# Altium schematic sheet Smart_Clock_ver2esp32.SchDoc
size A2
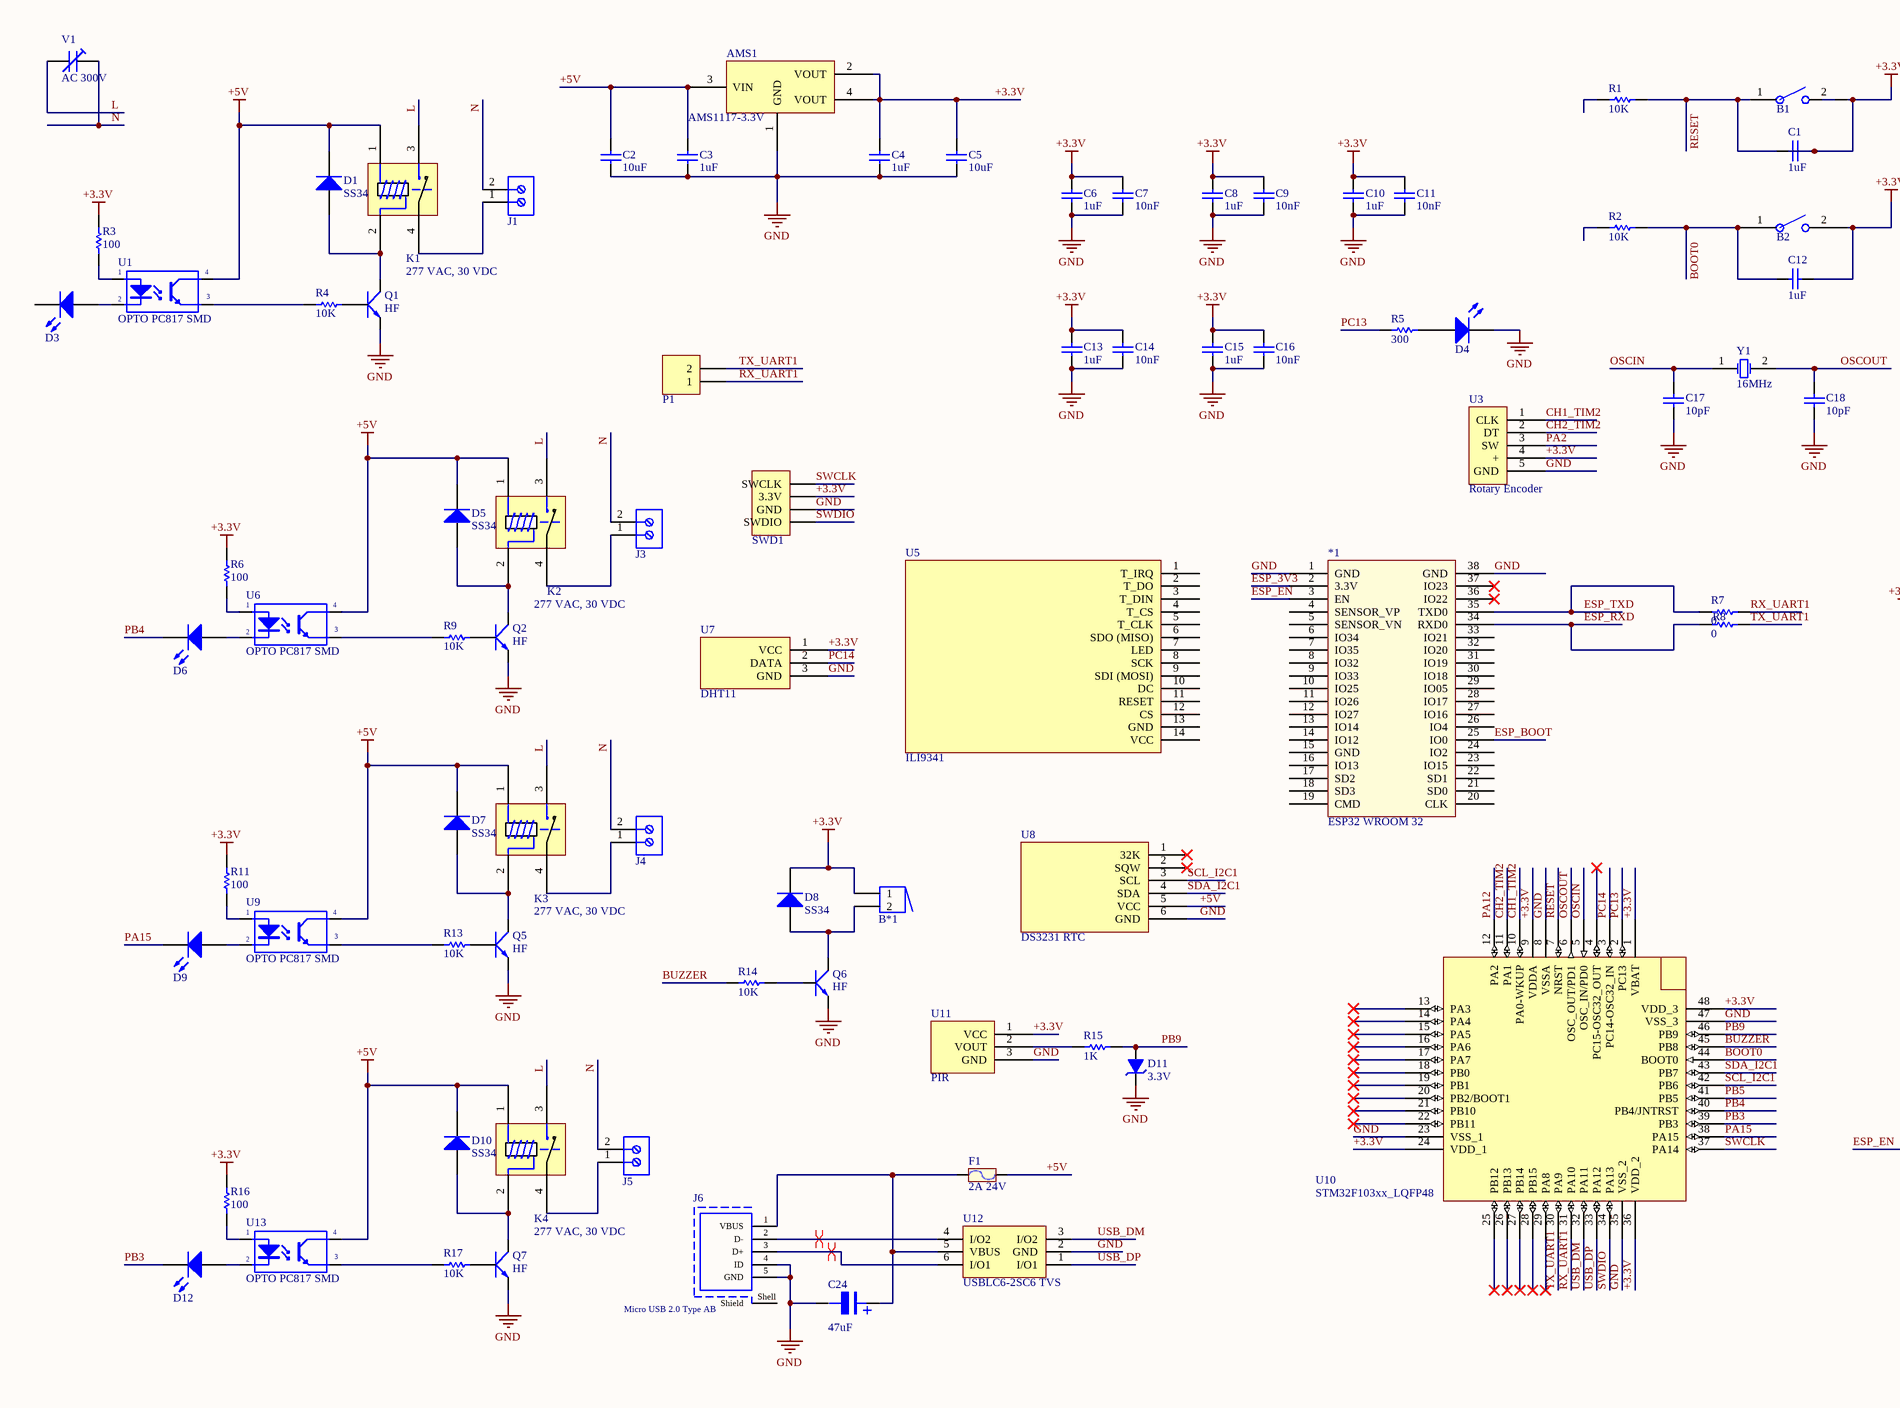
[diagram p0: Smart_Clock_ver2esp32.SchDoc, left]
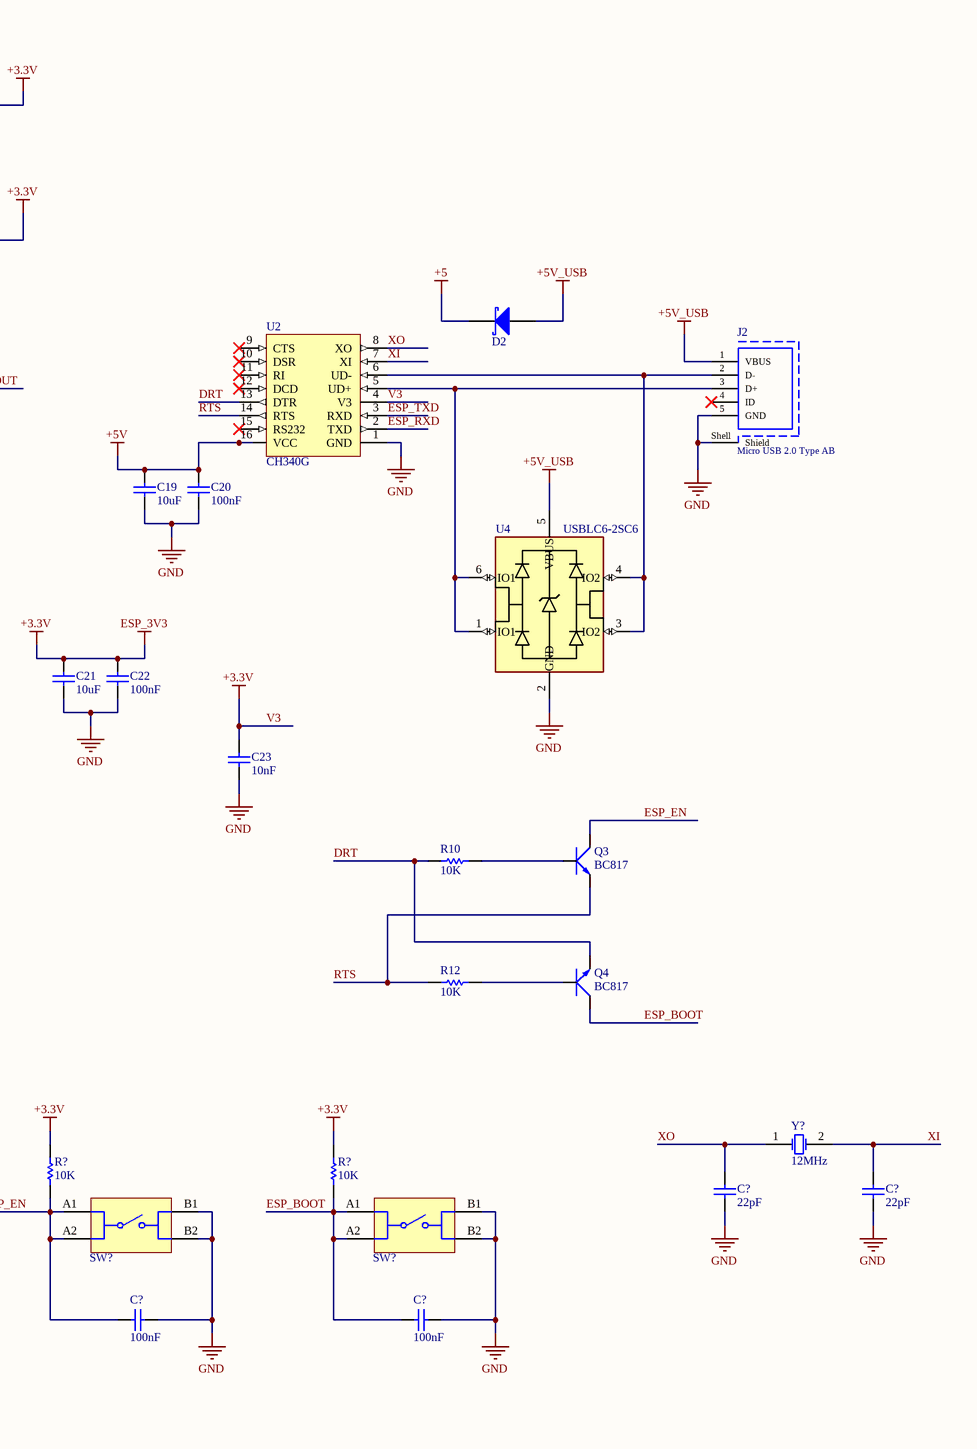
[diagram p1: Smart_Clock_ver2esp32.SchDoc, right]

## Parts
(Parts that share a designator on the sheet are numbered #1, #2 ... from top to bottom, then left to right.)
*1  ESP32 WROOM 32  [ESP32-WROOM-32D]
AMS1  AMS1117-3.3V  [SOT223]
B1  Button SMD 2 Pin 3x4mm  [BUTTON SMD 2 PIN]  (value not drawn)
B2  Button SMD 2 Pin 3x4mm  [BUTTON SMD 2 PIN]  (value not drawn)
B*1  Buzzer  [BUZZER]  (value not drawn)
C1  value 1uF  [CAP-SM-0805]  (hidden comment: Cap Non-Pol SMD)
C2  value 10uF  [CAP-SM-0805]  (hidden comment: Cap Non-Pol SMD)
C3  value 1uF  [CAP-SM-0805]  (hidden comment: Cap Non-Pol SMD)
C4  value 1uF  [CAP-SM-0805]  (hidden comment: Cap Non-Pol SMD)
C5  value 10uF  [CAP-SM-0805]  (hidden comment: Cap Non-Pol SMD)
C6  value 1uF  [CAP-SM-0805]  (hidden comment: Cap Non-Pol SMD)
C7  value 10nF  [CAP-SM-0805]  (hidden comment: Cap Non-Pol SMD)
C8  value 1uF  [CAP-SM-0805]  (hidden comment: Cap Non-Pol SMD)
C9  value 10nF  [CAP-SM-0805]  (hidden comment: Cap Non-Pol SMD)
C10  value 1uF  [CAP-SM-0805]  (hidden comment: Cap Non-Pol SMD)
C11  value 10nF  [CAP-SM-0805]  (hidden comment: Cap Non-Pol SMD)
C12  value 1uF  [CAP-SM-0805]  (hidden comment: Cap Non-Pol SMD)
C13  value 1uF  [CAP-SM-0805]  (hidden comment: Cap Non-Pol SMD)
C14  value 10nF  [CAP-SM-0805]  (hidden comment: Cap Non-Pol SMD)
C15  value 1uF  [CAP-SM-0805]  (hidden comment: Cap Non-Pol SMD)
C16  value 10nF  [CAP-SM-0805]  (hidden comment: Cap Non-Pol SMD)
C17  value 10pF  [CAP-SM-0805]  (hidden comment: Cap Non-Pol SMD)
C18  value 10pF  [CAP-SM-0805]  (hidden comment: Cap Non-Pol SMD)
C19  value 10uF  [CAP-SM-0805]  (hidden comment: Cap Non-Pol SMD)
C20  value 100nF  [CAP-SM-0805]  (hidden comment: Cap Non-Pol SMD)
C21  value 10uF  [CAP-SM-0805]  (hidden comment: Cap Non-Pol SMD)
C22  value 100nF  [CAP-SM-0805]  (hidden comment: Cap Non-Pol SMD)
C23  value 10nF  [CAP-SM-0805]  (hidden comment: Cap Non-Pol SMD)
C24  47uF  [tu nhom 6.3 (d)]
C?#1  value 22pF  [CAP-SM-0805]  (hidden comment: Cap Non-Pol SMD)
C?#2  value 22pF  [CAP-SM-0805]  (hidden comment: Cap Non-Pol SMD)
C?#3  value 100nF  [CAP-SM-0805]  (hidden comment: Cap Non-Pol SMD)
C?#4  value 100nF  [CAP-SM-0805]  (hidden comment: Cap Non-Pol SMD)
D1  SS34  [DIODE SMA]
D2  D Schottky  [SS34]  (value not drawn)
D3  LED SMD  [LED_0805_Blue]  (value not drawn)
D4  LED SMD  [LED_0603_Blue]  (value not drawn)
D5  SS34  [DIODE SMA]
D6  LED SMD  [LED_0805_Blue]  (value not drawn)
D7  SS34  [DIODE SMA]
D8  SS34  [DIODE SMA]
D9  LED SMD  [LED_0805_Blue]  (value not drawn)
D10  SS34  [DIODE SMA]
D11  3.3V  [DIODE ZENNER SMD SOD80]
D12  LED SMD  [LED_0805_Blue]  (value not drawn)
F1  2A 24V  [Cau chi tu phuc hoi 2A 24V SMD1812]
J1  10A, 300V  [691214110002]  (value not drawn)
J2  Micro USB 2.0 Type AB  [629105150921]
J3  10A, 300V  [691214110002]  (value not drawn)
J4  10A, 300V  [691214110002]  (value not drawn)
J5  10A, 300V  [691214110002]  (value not drawn)
J6  Micro USB 2.0 Type AB  [629105150921]
K1  277 VAC, 30 VDC  [HF46F]
K2  277 VAC, 30 VDC  [HF46F]
K3  277 VAC, 30 VDC  [HF46F]
K4  277 VAC, 30 VDC  [HF46F]
P1  Header 2  [JP2]  (value not drawn)
Q1  HF  [SOT-23]
Q2  HF  [SOT-23]
Q3  BC817  [SOT-23]
Q4  BC817  [SOT-23]
Q5  HF  [SOT-23]
Q6  HF  [SOT-23]
Q7  HF  [SOT-23]
R1  value 10K  [RES-SM-0805]  (hidden comment: RESISTOR SMD)
R2  value 10K  [RES-SM-0805]  (hidden comment: RESISTOR SMD)
R3  value 100  [RES-SM-0805]  (hidden comment: RESISTOR SMD)
R4  value 10K  [RES-SM-0805]  (hidden comment: RESISTOR SMD)
R5  value 300  [RES-SM-0805]  (hidden comment: RESISTOR SMD)
R6  value 100  [RES-SM-0805]  (hidden comment: RESISTOR SMD)
R7  value 0  [RES-SM-0805]  (hidden comment: RESISTOR SMD)
R8  value 0  [RES-SM-0805]  (hidden comment: RESISTOR SMD)
R9  value 10K  [RES-SM-0805]  (hidden comment: RESISTOR SMD)
R10  value 10K  [RES-SM-0805]  (hidden comment: RESISTOR SMD)
R11  value 100  [RES-SM-0805]  (hidden comment: RESISTOR SMD)
R12  value 10K  [RES-SM-0805]  (hidden comment: RESISTOR SMD)
R13  value 10K  [RES-SM-0805]  (hidden comment: RESISTOR SMD)
R14  value 10K  [RES-SM-0805]  (hidden comment: RESISTOR SMD)
R15  value 1K  [RES-SM-0805]  (hidden comment: RESISTOR SMD)
R16  value 100  [RES-SM-0805]  (hidden comment: RESISTOR SMD)
R17  value 10K  [RES-SM-0805]  (hidden comment: RESISTOR SMD)
R?#1  value 10K  [RES-SM-0805]  (hidden comment: RESISTOR SMD)
R?#2  value 10K  [RES-SM-0805]  (hidden comment: RESISTOR SMD)
SW?#1  430181038816  [WS-TASV_L4.5W4.5H3.8_430181038816]  (value not drawn)
SW?#2  430181038816  [WS-TASV_L4.5W4.5H3.8_430181038816]  (value not drawn)
SWD1  Header 4  [JP4]  (value not drawn)
U1  OPTO PC817 SMD  [SOP4]
U2  CH340G  [DSIP-16]
U3  Rotary Encoder  [Header 5 Pin]
U4  USBLC6-2SC6  [SOT95P280X145-6N]
U5  ILI9341  [ILI9341]
U6  OPTO PC817 SMD  [SOP4]
U7  DHT11  [DHT11]
U8  DS3231 RTC  [DS3231]
U9  OPTO PC817 SMD  [SOP4]
U10  STM32F103xx_LQFP48  [STM32_LQPF48]
U11  PIR  [PIR]
U12  USBLC6-2SC6 TVS  [SOT23-6]
U13  OPTO PC817 SMD  [SOP4]
V1  AC 300V  [Varistor]
Y1  16MHz  [WE-XTAL_HC49/4HSMX]
Y?  12MHz  [WE-XTAL_HC49/4HSMX]

## Nets
+3.3V: *1.2(3.3V) AMS1.2(VOUT) AMS1.4(VOUT) B1.2 B2.2 B*1.1 C1.2 C4.2 C5.2 C6.2 C7.2 C8.2 C9.2 C10.2 C11.2 C12.2 C13.2 C14.2 C15.2 C16.2 C21.2 C22.2 C23.2 D8.2(K) R3.2 R6.2 R11.2 R16.2 R?#1.2 R?#2.2 SWD1.3(3.3V) U2.4(V3) U3.4(+) U7.1(VCC) U10.1(VBAT) U10.9(VDDA) U10.24(VDD_1) U10.36(VDD_2) U10.48(VDD_3) U11.1(VCC)  [also labelled ESP_3V3, V3]
+5: D2.2(K)
+5V: AMS1.3(VIN) C2.2 C3.2 C19.2 C20.2 D1.2(K) D5.2(K) D7.2(K) D10.2(K) F1.2 K1.1(Coil) K2.1(Coil) K3.1(Coil) K4.1(Coil) U1.4(C) U2.16(VCC) U6.4(C) U8.5(VCC) U9.4(C) U13.4(C)
+5V_USB: D2.1(A) J2.1(VBUS) U4.5(VBUS)
GND: *1.1(GND) *1.38(GND) AMS1.1(GND) C2.1 C3.1 C4.1 C5.1 C6.1 C7.1 C8.1 C9.1 C10.1 C11.1 C13.1 C14.1 C15.1 C16.1 C17.2 C18.2 C19.1 C20.1 C21.1 C22.1 C23.1 C24.2 C?#1.2 C?#2.2 C?#3.2 C?#4.1 D4.2(K) D11.2(K) J2.5(GND) J2.Shell(Shield) J6.4(ID) J6.5(GND) Q1.2(E) Q2.2(E) Q5.2(E) Q6.2(E) Q7.2(E) SW?#1.B1 SW?#1.B2 SW?#2.B1 SW?#2.B2 SWD1.2(GND) U2.1(GND) U3.5(GND) U4.2(GND) U7.3(GND) U8.6(GND) U10.8(VSSA) U10.23(VSS_1) U10.35(VSS_2) U10.47(VSS_3) U11.3(GND) U12.2(GND)
BOOT0: B2.1 C12.1 R2.2 U10.44(BOOT0)
BUZZER: R14.1 U10.45(PB8)
CH1_TIM2: U3.1(CLK) U10.10(PA0-WKUP)
CH2_TIM2: U3.2(DT) U10.11(PA1)
DRT: Q4.2(E) R10.1 U2.13(DTR)
ESP_BOOT: *1.25(IO0) C?#4.2 Q4.3(C) R?#2.1 SW?#2.A1 SW?#2.A2
ESP_EN: *1.3(EN) C?#3.1 Q3.3(C) R?#1.1 SW?#1.A1 SW?#1.A2
ESP_RXD: *1.34(RXD0) R8.1 U2.2(TXD)
ESP_TXD: *1.35(TXD0) R7.1 U2.3(RXD)
L: K1.3(NO) K2.3(NO) K3.3(NO) K4.3(NO) V1.1
N: J1.2 J3.2 J4.2 J5.2 V1.2
OSCIN: C17.1 U10.5(OSC_IN/PD0) Y1.1(OSC1)
OSCOUT: C18.1 U10.6(OSC_OUT/PD1) Y1.2(OSC2)
PA2: U3.3(SW)
PA12: U10.12(PA2)
PA15: D9.2(K) U10.38(PA15)
PB3: D12.2(K) U10.39(PB3)
PB4: D6.2(K) U10.40(PB4/JNTRST)
PB5: U10.41(PB5)
PB9: D11.1(A) R15.2 U10.46(PB9)
PC13: R5.1 U10.2(PC13)
PC14: U7.2(DATA) U10.3(PC14-OSC32_IN)
RESET: B1.1 C1.1 R1.2 U10.7(NRST)
RTS: Q3.2(E) R12.1 U2.14(RTS)
RX_UART1: P1.1 R7.2 U10.31(PA10)
SCL_I2C1: U8.3(SCL) U10.42(PB6)
SDA_I2C1: U8.4(SDA) U10.43(PB7)
SWCLK: SWD1.4(SWCLK) U10.37(PA14)
SWDIO: SWD1.1(SWDIO) U10.34(PA13)
TX_UART1: P1.2 R8.2 U10.30(PA9)
USB_DM: U10.32(PA11) U12.3(I/O2)
USB_DP: U10.33(PA12) U12.1(I/O1)
XI: C?#2.1 U2.7(XI) Y?.2(OSC2)
XO: C?#1.1 U2.8(XO) Y?.1(OSC1)
NetB*1_2: B*1.2 D8.1(A) Q6.3(C)
NetC24_1: C24.1 F1.1 J6.1(VBUS) U12.5(VBUS)
NetD1_1: D1.1(A) K1.2(Coil) Q1.3(C)
NetD3_1: D3.1(A) U1.2(K)
NetD4_1: D4.1(A) R5.2
NetD5_1: D5.1(A) K2.2(Coil) Q2.3(C)
NetD6_1: D6.1(A) U6.2(K)
NetD7_1: D7.1(A) K3.2(Coil) Q5.3(C)
NetD9_1: D9.1(A) U9.2(K)
NetD10_1: D10.1(A) K4.2(Coil) Q7.3(C)
NetD12_1: D12.1(A) U13.2(K)
NetJ1_1: J1.1 K1.4
NetJ2_2: J2.2(D-) U2.6(UD-) U4.3(IO2) U4.4(IO2)
NetJ2_3: J2.3(D+) U2.5(UD+) U4.1(IO1) U4.6(IO1)
NetJ3_1: J3.1 K2.4
NetJ4_1: J4.1 K3.4
NetJ5_1: J5.1 K4.4
NetJ6_2: J6.2(D-) U12.4(I/O2)
NetJ6_3: J6.3(D+) U12.6(I/O1)
NetQ1_1: Q1.1(B) R4.1
NetQ2_1: Q2.1(B) R9.1
NetQ3_1: Q3.1(B) R10.2
NetQ4_1: Q4.1(B) R12.2
NetQ5_1: Q5.1(B) R13.1
NetQ6_1: Q6.1(B) R14.2
NetQ7_1: Q7.1(B) R17.1
NetR3_1: R3.1 U1.1(A)
NetR4_2: R4.2 U1.3(E)
NetR6_1: R6.1 U6.1(A)
NetR9_2: R9.2 U6.3(E)
NetR11_1: R11.1 U9.1(A)
NetR13_2: R13.2 U9.3(E)
NetR15_1: R15.1 U11.2(VOUT)
NetR16_1: R16.1 U13.1(A)
NetR17_2: R17.2 U13.3(E)

Not connected (* = marked no-connect by the designer): *1 4(SENSOR_VP) 5(SENSOR_VN) 6(IO34) 7(IO35) 8(IO32) 9(IO33) 10(IO25) 11(IO26) 12(IO27) 13(IO14) 14(IO12) 15(GND) 16(IO13) 17(SD2) 18(SD3) 19(CMD) 20(CLK) 21(SD0) 22(SD1) 23(IO15) 24(IO2) 26(IO4) 27(IO16) 28(IO17) 29(IO05) 30(IO18) 31(IO19) 32(IO20) 33(IO21) 36(IO22)* 37(IO23)*; D3 2(K); J2 4(ID)*; J6 Shell(Shield); R1 1; R2 1; U2 9(CTS)* 10(DSR)* 11(RI)* 12(DCD)* 15(RS232)*; U5 1(T_IRQ) 2(T_DO) 3(T_DIN) 4(T_CS) 5(T_CLK) 6(SDO_(MISO)) 7(LED) 8(SCK) 9(SDI_(MOSI)) 10(DC) 11(RESET) 12(CS) 13(GND) 14(VCC); U8 1(32K)* 2(SQW)*; U10 4(PC15-OSC32_OUT)* 13(PA3)* 14(PA4)* 15(PA5)* 16(PA6)* 17(PA7)* 18(PB0)* 19(PB1)* 20(PB2/BOOT1)* 21(PB10)* 22(PB11)* 25(PB12)* 26(PB13)* 27(PB14)* 28(PB15)* 29(PA8)*

## Layout directives
differential pair: NetJ6_2, NetJ6_3

## Notes on the sheet
- (in symbol Tu Nhom 47uF 50V) +

## Library data of the parts
AMS1 = AMS1117 SMD: Dán; Value: AMS1117-3.3V SOT223; Don_Vi: Con; Ma_Hang: MH000596; Ghi_Chu: *; Kieu_Chan: *; Chung_Loai: Dán
B1 B2 = BUTTON
C1-C23 C?#1-C?#4 = Cap Non-Pol SMD: Capacitor
C24 = Tu Nhom 47uF 50V: Dán; Don_Vi: Con; So_Chan: 2; Ten_Linh_Kien: Tụ Nhôm 47uF 50V 6.3x5.5MM; Ma_Hang: MH002217; Chung_Loai: Dán; Kieu_Chan: *
D1 D5 D7 D8 D10 = Diode SS34 ( 1N5822 ): Dán; Don_Vi: Con; Ma_Hang: MH002104; Ten_Linh_Kien: Diode SS34 3A 40V SMA ( 1N5822 SS34A); Kieu_Chan: *; Chung_Loai: Dán
D2 = D Schottky: Schottky Diode; Published: 8-Jun-2000; LatestRevisionDate: 17-Jul-2002; LatestRevisionNote: Re-released for DXP Platform.; PackageReference: SMB; Publisher: Altium Limited; PackageDescription: DO-214-AA/SMB; 2 C-Bend Leads; Body 5.3 x 3.6 mm, inc. leads (LxW); Code_JEDEC: DO-214-AA
D3 D4 D6 D9 D12 = LED SMD: LED
D11 = Diode Zener 3.3V: Dán; Don_Vi: Con; Ma_Hang: MH002880; Ten_Linh_Kien: Diode Zener 1/2W 3.3V SMD1206 ZMM3.3; Kieu_Chan: *; Ghi_Chu: *; Chung_Loai: Dán
F1 = Cau chi tu phuc hoi 2A 24V SMD1812: 2A 24V SMD1812; Ma_Hang: MH010033; Ten: Cầu Chì Tự Phục Hồi 2A 24V SMD1812
J1 J3-J5 = 691214110002: WR-TBL Series 2141 Horizontal Entry Modular, THT, pitch 3.5mm, 2p; Manufacturer: Wurth Elektronik; Modularity: Yes; ComponentLink1Description: Website Link; ComponentLink1URL: https://www.we-online.com/redexpert/article/691214110002?ad; ComponentLink2Description: Supplier 1 URL; ComponentLink2URL: N/A; Manufacturer Part Number: 691214110002; Category: Terminal Blocks; Match Code: WR-TBL; Mount: Through Hole; Operating Temperature Max: 105°C; Operating Temperature Min: -40°C; Packaging: Box; Application: Rising Cage Clamp; Number of Pins: 2; Number of Rows: 1; Orientation: Horizontal; Pitch: 3.5mm; Rated Current: 10A; Working Voltage: 300V; ComponentLink3Description: Supplier 2 URL; ComponentLink3URL: N/A; ComponentLink4Description: Supplier 3 URL; ComponentLink4URL: https://www.thegioiic.com/kf350-2-v-domino-2-chan-thang-3-5mm-300v-10a-han-pcb; Supplier 1 Name: Mouser; Supplier 1 SN: N/A; Supplier 1 URL: N/A; Supplier 2 Name: Digi-Key; Supplier 2 SN: N/A; Supplier 2 URL: N/A; Supplier 3 Name: thegioiic; Supplier 3 SN: N/A; Supplier 3 URL: https://www.thegioiic.com/kf350-2-v-domino-2-chan-thang-3-5mm-300v-10a-han-pcb; Value: 10A, 300V
J2 J6 = 629105150921: Micro USB 2.0 Type AB Receptacle WR-COM, Horizontal, SMT; Rated Current: 1.8 A; Contact Resistance: 30 mOhm; Working Voltage: 30 VAC; ComponentLink1Description: Datasheet; ComponentLink1URL: https://katalog.we-online.de/em/datasheet/629105150921.pdf; ComponentLink2Description: Supplier 1 URL; ComponentLink2URL: N/A; Part Number: 629105150921; Published Date: September 2018; Publisher: Wurth Elektronik; Orientation: Horizontal; Connector Type: Micro USB 2.0 Type AB; Operating Temperature: -40 to 85 degC; Mounting Technology: SMT; Gender: Receptacle; Packaging: Tape and Reel; ComponentLink3Description: Supplier 2 URL; ComponentLink3URL: N/A; ComponentLink4Description: Supplier 3 URL; ComponentLink4URL: N/A; Supplier 1 Name: Mouser; Supplier 1 SN: 710-629105150921; Supplier 1 URL: https://www.mouser.vn/ProductDetail/Wurth-Elektronik/629105150921?qs=a9WhcLg8qCztfCBvRE9gEg%3D%3D; Supplier 2 Name: Digi-Key; Supplier 2 SN: N/A; Supplier 2 URL: N/A; Supplier 3 Name: thegioiic; Supplier 3 SN: N/A; Supplier 3 URL: N/A; Value: Micro USB 2.0 Type AB
K1-K4 = HF46F-G 12-HS1: Coil Voltage: 12 VDC; Contact Current Rating: 7A; Switching Voltage Max: 277 VAC, 30 VDC; Coil Voltage: 12 VDC; Associated Relay Series: N/A; Coil Current: N/A; Coil Resistance: N/A; ComponentLink1Description: Datasheet link; ComponentLink1URL: https://source.hongfa.com//pdf/web/viewer.html?file=/Uploads/Product/PDF/HF46F-G_en.pdf?timestamp=1691116874; ComponentLink2Description: Supplier 1 URL; ComponentLink2URL: N/A; ComponentLink3Description: Supplier 2 URL; ComponentLink3URL: N/A; ComponentLink4Description: Supplier 3 URL; ComponentLink4URL: https://www.thegioiic.com/hf46f-g-12-hs1-ro-le-12vdc-7a-spst-no-4-chan; Power Consumption: N/A; Supplier 1 Name: Mouser; Supplier 1 SN: N/A; Supplier 1 URL: N/A; Supplier 2 Name: Digi-Key; Supplier 2 SN: N/A; Supplier 2 URL: N/A; Supplier 3 Name: thegioiic; Supplier 3 SN: N/A; Supplier 3 URL: https://www.thegioiic.com/hf46f-g-12-hs1-ro-le-12vdc-7a-spst-no-4-chan; Value: 277 VAC, 30 VDC
P1 = Header 2: Header, 2-Pin; LatestRevisionDate: 17-Jul-2002; LatestRevisionNote: Re-released for DXP Platform.; Publisher: Altium Limited
Q1 Q2 Q5-Q7 = Trans C1815 HF SMD: SOT-23; Value: C9014
Q3 Q4 = Trans BC817: SOT-23 - C8658; Value: C9014
R1-R17 R?#1 R?#2 = RESISTOR SMD: Resistor
SW?#1 SW?#2 = 430181038816: WS-TASV SMT Tact Switch, L4.5 x W4.5 x H3.8mm, 160g, SPST-NO, 12V, 50mA; Manufacturer: Wurth Elektronik; Washable: No; Rated Voltage: 12VDC; Manufacturer Part Number: 430181038816; Category: Tact Switches; Match Code: WS-TASV; Mount: Surface Mount; Operating Temperature Max: 85°C; Operating Temperature Min: -40°C; Packaging: Tape and Reel; Length: 4.5mm; Width: 4.5mm; Height: 3.8mm; Circuit: SPST-NO; Contact Material: Stainless Steel; Operation Force: 160g; Rated Current: 50mA; Terminal Material: Copper Alloy; Terminal Plating: Silver; Supplier 1 URL: https://www.mouser.vn/ProductDetail/Wurth-Elektronik/430181038816?qs=wr8lucFkNMWIANaPOquJXg%3D%3D; Supplier 2 URL: https://www.digikey.com/en/products/detail/w%C3%BCrth-elektronik/430181038816/5209016?s=N4IgTCBcDaICwGYAMBGAHCpC0YGwgF0BfIA; Supplier 3 URL: https://www.thegioiic.com/nut-nhan-4-5x4-5mm-cao-3-8mm-4-chan-smd; LCSC Part #: N/A; ComponentLink1Description: Datasheet; ComponentLink1URL: https://www.we-online.com/redexpert/spec/430181038816?ad; Package / Case: 0805; Supplier 1: Mouser; Supplier 1 Part Number: 710-430181038816; Supplier 2: Digi-Key; Supplier 2 Part Number: 732-7003-2-ND; Supplier 3: thegioiic; Supplier 3 Part Number: OEM; Value: 430181038816
SWD1 = Header 4: Header, 4-Pin; LatestRevisionDate: 17-Jul-2002; LatestRevisionNote: Re-released for DXP Platform.; Publisher: Altium Limited
U1 U6 U9 U13 = OPTO PC817 SMD: Single Opto; Value: PC817
U2 = CH340: USB Bridge, USB to UART USB 2.0 UART Interface; Mfr: SparkFun Electronics; Standards: USB 2.0; Voltage - Supply: 3V ~ 3.6V; Current - Supply: 20mA; Protocol: USB; Function: Bridge, USB to UART; Interface: UART; Operating Temperature: -20°C ~ 70°C (TA); ComponentLink1Description: Thegioiic; ComponentLink1URL: https://www.thegioiic.com/ch340g; ComponentLink2Description: Datasheet; ComponentLink2URL: https://www.thegioiic.com/upload/documents/5d39d5f0043101a4c964078db79fe1bd.PDF
U4 = USBLC6-2SC6: 17V Clamp 5A (8/20Âµs) Ipp Tvs Diode Surface Mount SOT-23-6
U5 = ILI9341: ILI9341 Module 3.2 240x320
U8 = DS3231: DS3231 RTC Module
U12 = IC_LTC6992IS6-1: Oscillator, Silicon IC 3.81Hz ~ 1MHz TSOT-23-6; Manufacturer: Linear Technology/Analog Devices; Alternate Part Number-1: NA; Manufacturer Part Number: LTC6992IS6-1; Case/Package: SOT-23-6; Supplier-1: Arrow; Supplier Part Number-1: LTC6992IS6-1#TRMPBF
V1 = 05000730110: Varistors 7D471K AC 300V; Manufacture  Name: Bourns; Tolerance: +/- 10%; Diameter: 7mm; Capacitance: N/A; ComponentLink1Description: Datasheet link; ComponentLink1URL: N/A; Voltage: 300V; Manufacture  SN: 7D471K; ComponentLink2Description: Supplier 1 URL; ComponentLink2URL: N/A; ComponentLink3Description: Supplier 2 URL; ComponentLink3URL: N/A; ComponentLink4Description: Supplier 3 URL; ComponentLink4URL: N/A; Supplier 1 Name: Mouser; Supplier 1 SN: N/A; Supplier 1 URL: N/A; Supplier 2 Name: Digi-Key; Supplier 2 SN: N/A; Supplier 2 URL: N/A; Supplier 3 Name: thegioiic; Supplier 3 SN: N/A; Supplier 3 URL: https://www.thegioiic.com/tu-chong-set-varistor-7d471k-300v; Value: AC 300V
Y1 Y? = 071105166016: WE-XTAL Quartz Crystal, SMT, HC49/4HSMX, 16MHz, +/-30ppm; Manufacturer Part Number: 830003237; Manufacturer: Wurth Elektronik; Frequency Stability: +/-50ppm; Load Capacitance: 16pF; ComponentLink2Description: Supplier 1 URL; ComponentLink2URL: https://www.mouser.com/ProductDetail/Wurth-Elektronik/830003237?qs=2WXlatMagcFy7La1wROd1w%3D%3D; Operating Temperature: -10 to +60degC; Size: HC49/4HSMX; Frequency: 16MHz; Frequency Tolerance: +/-30ppm; Mounting Technology: SMT; Supplier 3 Name: thegioiic; Supplier 3 SN: N/A; Supplier 3 URL: https://www.thegioiic.com/thach-anh-16mhz-2-chan-smd-hc49-s; ComponentLink1Description: Datasheet link; ComponentLink1URL: https://katalog.we-online.com/pbs/datasheet/830003237.pdf; ComponentLink3Description: Supplier 2 URL; ComponentLink3URL: https://www.digikey.com/en/products/detail/w%C3%BCrth-elektronik/830003237/13979248; ComponentLink4Description: Supplier 3 URL; ComponentLink4URL: https://www.thegioiic.com/thach-anh-16mhz-2-chan-smd-hc49-s; Supplier 1 Name: Mouser; Supplier 1 SN: 710-830003237; Supplier 1 URL: https://www.mouser.com/ProductDetail/Wurth-Elektronik/830003237?qs=2WXlatMagcFy7La1wROd1w%3D%3D; Supplier 2 Name: Digi-Key; Supplier 2 SN: 732-830003237TR-ND; Supplier 2 URL: https://www.digikey.com/en/products/detail/w%C3%BCrth-elektronik/830003237/13979248; Value: 16MHz
U10 = STM32F103xx_LQFP48: Published: 30-May-2008; DatasheetVersion: rev6, Mar-2008; PackageVersion: Mar-2008; PackageReference: LQFP48; Publisher: Altium Limited; PackageDescription: 48-Pin Low-Profile Quad Flat Pack, 7 x 7 mm Body, 0.5 mm Pitch (LQFP48); ComponentLink1Description: Manufacturer Link; ComponentLink1URL: www.st.com/stm32; ComponentLink2Description: Datasheet; ComponentLink2URL: http://www.st.com/stonline/products/literature/ds/13587.pdf